# EAGLE design garber1 (EAGLE 9.6.2)
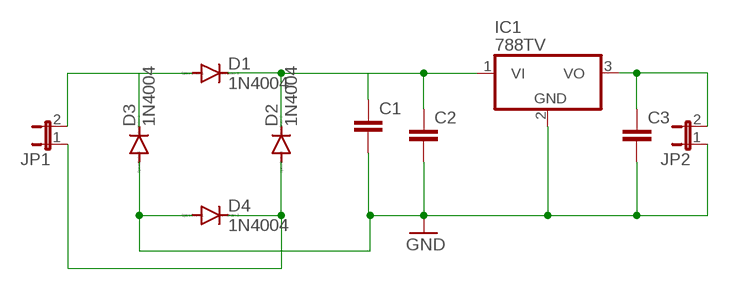
[diagram p0: schematic, sheet 1]

## Parts
C1  C2,5-3  [C2.5-3]
C2  C2,5-3  [C2.5-3]
C3  C2,5-3  [C2.5-3]
D1  1N4004  [DO41-10]
D2  1N4004  [DO41-10]
D3  1N4004  [DO41-10]
D4  1N4004  [DO41-10]
IC1  788TV  [TO220V]
JP1  JP1E  [JP1]
JP2  JP1E  [JP1]

## Nets
GND: C1.2 C2.2 C3.2 D3.A D4.A IC1.2(GND) JP2.1
N$1: D1.A D3.C JP1.2
N$4: C1.1 C2.1 D1.C D2.C IC1.1(VI)
N$5: C3.1 IC1.3(VO) JP2.2
N$6: D2.A D4.C JP1.1

## Library data of the parts
C1-C3 = capacitor-wima:C: CAPACITOR naming: grid - package width
D1-D4 = diode:1N4004: DIODE general purpose rectifier, 1 A
IC1 = linear:78*: Positive VOLTAGE REGULATOR Source: http://cache.national.com/ds/LM/LM78L05.pdf http://www.fairchildsemi.com/ds/LM/LM7805.pdf
JP1 JP2 = jumper:JP1E: JUMPER

## Board
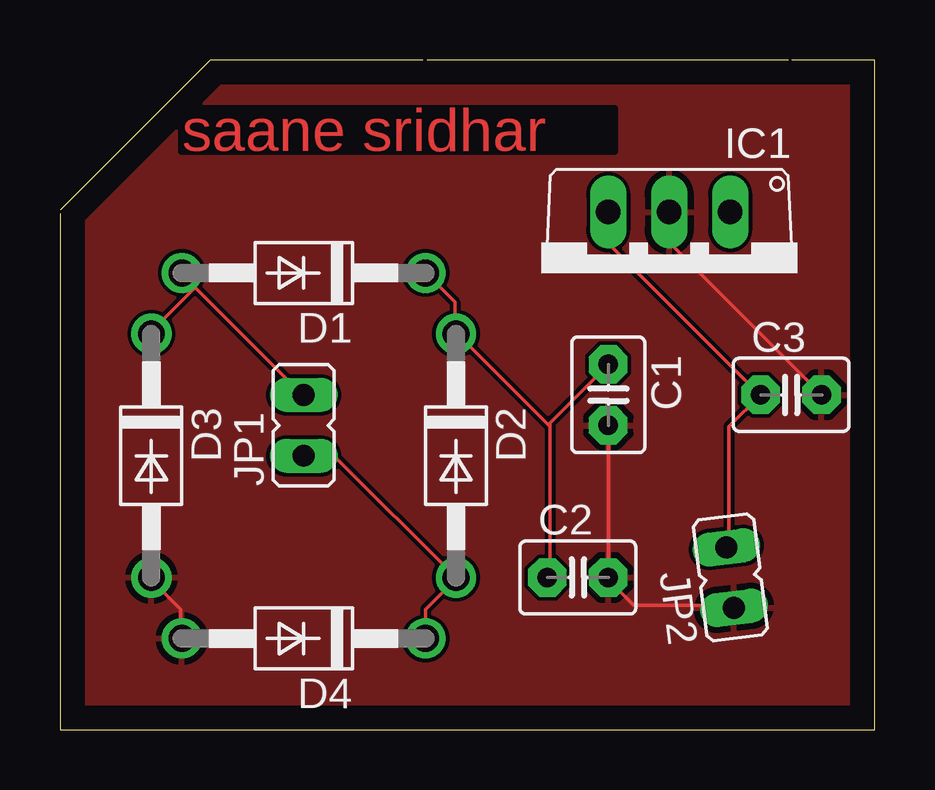
[diagram p1: board, top side]
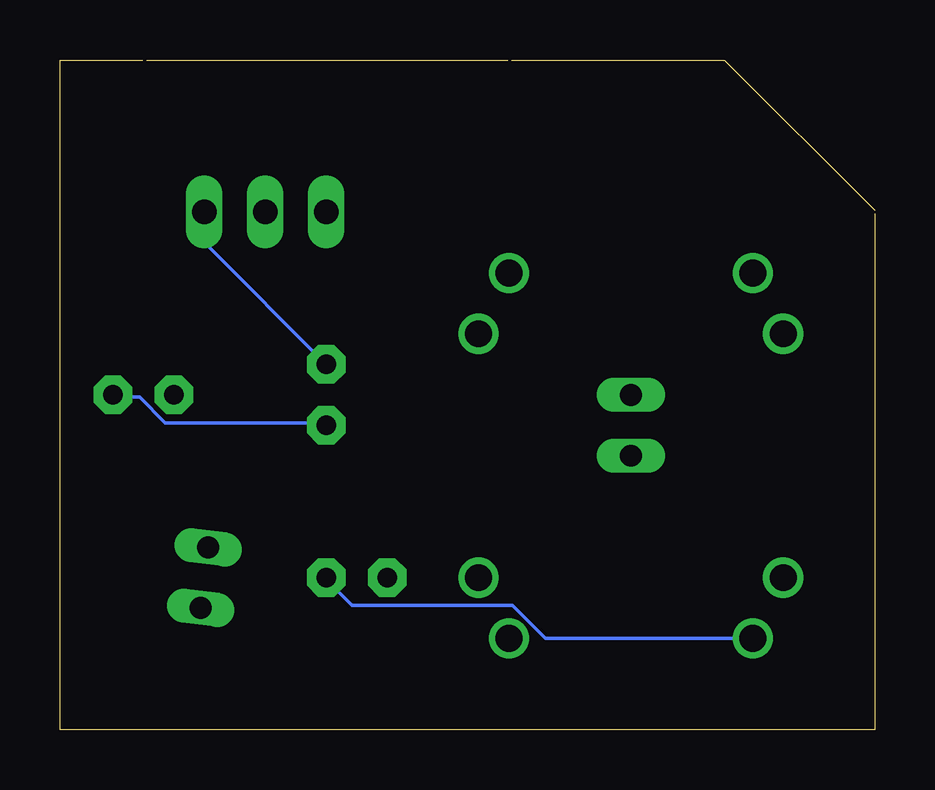
[diagram p2: board, bottom side, seen from below]

Size 33.96 x 27.93 mm. Coordinates in mm from the lower left corner, seen from the top.
Outline: 30.51,27.93 33.96,27.93 33.96,0 0,0 0,21.51
Outline: 15.14,27.93 6.26,27.93 0,21.67
Outline: 30.36,27.93 15.29,27.93
Copper layers (1*16): Top 0.035mm / dielectric 1.5mm / Bottom 0.035mm
Design rules "default": minimum track width 6mil, minimum drill 0.35mm, track to track 6mil, track to pad 6mil, pad to pad 6mil, via to via 6mil, smd to smd 6mil, copper to edge 40mil, drill to drill 6mil, minimum pad ring 10mil, minimum via ring 8mil, stop-mask expansion 4mil, vias tented up to drill 0mil, thermal gap 10mil

### Footprints (pad centres in the part's own frame; a part is rotated, then mirrored left to right if it is on the bottom)
C2.5-3 = drill 0.813 pad 1.6 octagon: 1 -1.27,0; 2 1.27,0
DO41-10 = drill 1.118: A 5.08,0; C -5.08,0
TO220V = drill 1.016 long: 1 -2.54,-2.54; 2 0,-2.54; 3 2.54,-2.54
JP1 = drill 0.914 long: 1 0,-1.27; 2 0,1.27

### Placement (x,y rotation side)
C1  22.86,13.97 270 top
C2  21.59,6.35 0 top
C3  30.48,13.97 0 top
D1  10.16,19.05 180 top
D2  16.51,11.43 270 top
D3  3.81,11.43 270 top
D4  10.16,3.81 180 top
IC1  25.4,19.05 180 top
JP1  10.16,12.7 0 top
JP2  27.94,6.35 7.1 top

### Tracks (layer width: path | path; a pad name or v marks a point on that pad's centre or on a via)
GND
  Top 0.152: C3.2 25.45,20.27 25.45,21.49 IC1.2 | D4.A 5.03,3.81 5.03,5.03 3.81,6.25 D3.A | JP2.1 28.04,5.18 23.93,5.18 22.86,6.25 C2.2 C1.2
  Bottom 0.152: D4.A 13.72,3.81 15.09,5.18 21.79,5.18 22.86,6.25 C2.2 | C3.2 31.7,13.87 30.63,13.87 29.57,12.8 22.86,12.8 C1.2
  pour Top: 5.08,30.48 36.83,30.48 36.83,-1.27 -1.27,-1.27 -1.27,30.48
  pour Top: -2.54,31.75 -2.54,-2.54 38.1,-2.54 38.1,31.75
N$1
  Top 0.152: 5.64,18.44 5.03,19.05 D1.A 5.64,18.44 | 5.64,18.44 10.06,14.02 JP1.2 | 5.64,18.44 3.81,16.61 D3.C
N$4
  Top 0.152: D1.C 16.46,17.83 16.46,16.61 D2.C 16.61,16.46 20.42,12.65 | 20.42,12.65 20.42,12.8 C1.1 | 20.42,12.65 20.42,6.4 C2.1
  Bottom 0.152: C1.1 27.89,20.27 27.89,21.49 IC1.1
N$5
  Top 0.152: JP2.2 27.89,7.62 27.89,12.65 C3.1 29.11,14.02 22.86,20.27 IC1.3
N$6
  Top 0.152: JP1.1 11.43,11.43 D2.A 16.46,6.25 15.24,5.03 D4.C

### Text on the board
Top: saane sridhar